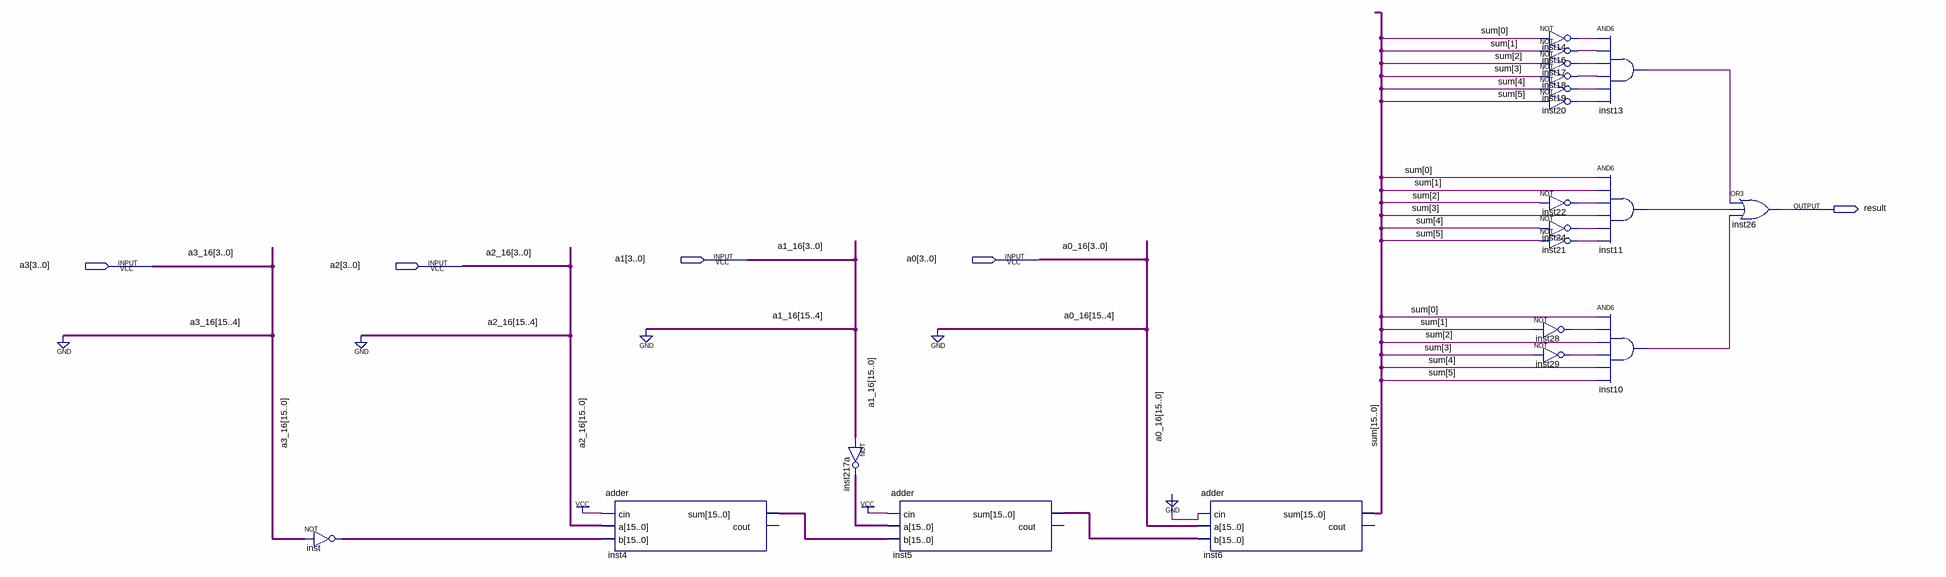
[diagram p0: schematic sheet]
// Quartus schematic div11.bdf as structural Verilog: 20 symbols, 5 pins
module div11 (
  input  [3:0] a1,
  input  [3:0] a0,
  input  [3:0] a3,
  input  [3:0] a2,
  output result
);

  wire inst10_out, inst11_out, inst13_out, inst14_out, inst16_out, inst17_out, inst18_out, inst19_out,
       inst20_out, inst21_out, inst22_out, inst24_out, inst28_out, inst29_out;
  wire [15:0] inst4_sum, inst5_sum, inst217a_out, inst_out, sum;

  assign inst_out = ~{{12{1'b0}}, a3};  // NOT inst, 16 bits wide
  adder inst4 (.cin(1'b1), .a({{12{1'b0}}, a2}), .b(inst_out), .sum(inst4_sum));  // open: cout
  assign inst217a_out = ~{{12{1'b0}}, a1};  // NOT inst217a, 16 bits wide
  adder inst5 (.cin(1'b1), .a(inst217a_out), .b(inst4_sum), .sum(inst5_sum));  // open: cout
  adder inst6 (.cin(1'b0), .a({{12{1'b0}}, a0}), .b(inst5_sum), .sum(sum));  // open: cout
  not inst14 (inst14_out, sum[0]);
  not inst16 (inst16_out, sum[1]);
  not inst17 (inst17_out, sum[2]);
  not inst18 (inst18_out, sum[3]);
  not inst19 (inst19_out, sum[4]);
  not inst20 (inst20_out, sum[5]);
  not inst22 (inst22_out, sum[2]);
  not inst24 (inst24_out, sum[4]);
  not inst21 (inst21_out, sum[5]);
  not inst28 (inst28_out, sum[1]);
  not inst29 (inst29_out, sum[3]);
  and inst13 (inst13_out, inst14_out, inst16_out, inst17_out, inst18_out, inst19_out, inst20_out);
  and inst11 (inst11_out, sum[0], sum[1], inst22_out, sum[3], inst24_out, inst21_out);
  and inst10 (inst10_out, sum[0], inst28_out, sum[2], inst29_out, sum[4], sum[5]);
  or inst26 (result, inst13_out, inst11_out, inst10_out);

  // Other names for the same wires on the sheet: a0_16[3:0] = a0; a1_16[3:0] = a1; a2_16[3:0] = a2; a3_16[3:0] = a3
endmodule
